# EAGLE schematic max_3949_breakout (EAGLE 9.2.2)
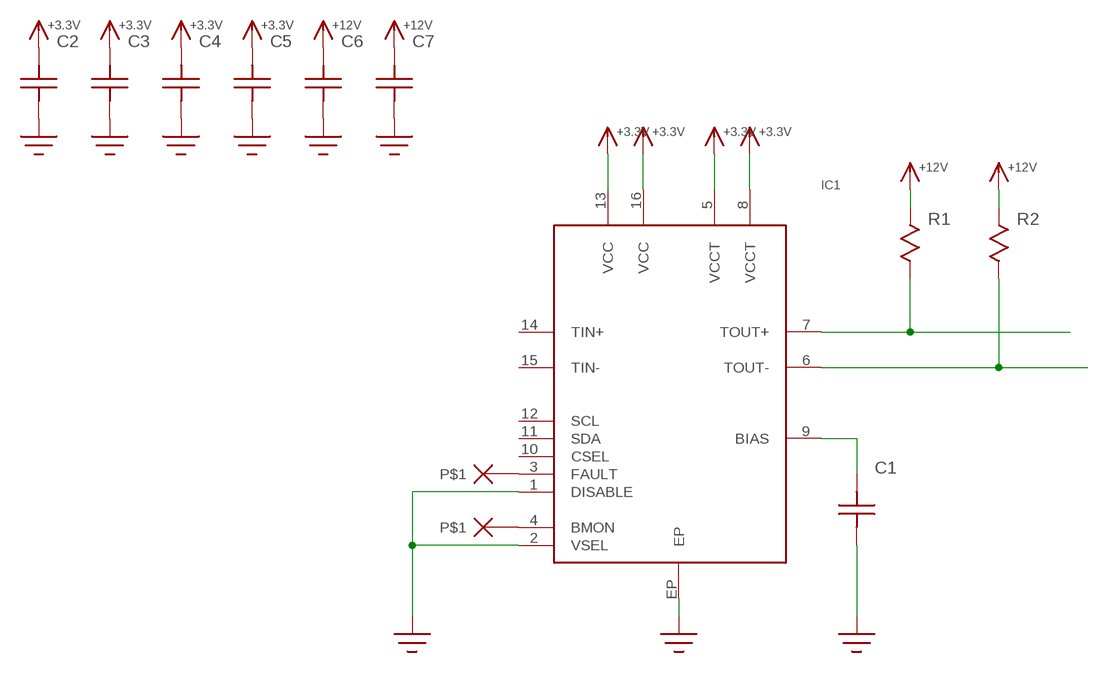
[diagram p0: schematic, sheet 1]

## Parts
C1  C0603  [C0603]
C2  C0603  [C0603]
C3  C0603  [C0603]
C4  C0603  [C0603]
C5  C0603  [C0603]
C6  C0603  [C0603]
C7  C0603  [C0603]
IC1  MAX3949  [TQFN16]
R1  R1206  [R1206]
R2  R1206  [R1206]
U$22  NO_CONNECT  (no package)
U$23  NO_CONNECT  (no package)

## Nets
+3.3V: C2.P$2 C3.P$2 C4.P$2 C5.P$2 IC1.5(VCCT) IC1.8(VCCT) IC1.13(VCC) IC1.16(VCC)
+12V: C6.P$2 C7.P$2 R1.P$1 R2.P$1
GND: C1.P$1 C2.P$1 C3.P$1 C4.P$1 C5.P$1 C6.P$1 C7.P$1 IC1.1(DISABLE) IC1.2(VSEL) IC1.EP
N$1: C1.P$2 IC1.9(BIAS)
N$2: IC1.7(TOUT+) R1.P$2
N$3: IC1.6(TOUT-) R2.P$2
N$5: IC1.3(FAULT) U$22.P$1
N$6: IC1.4(BMON) U$23.P$1
Unconnected: IC1.10(CSEL) IC1.11(SDA) IC1.12(SCL) IC1.14(TIN+) IC1.15(TIN-)

## Library data of the parts
C1-C7 = yapo:C
IC1 = yapo:MAX3949
R1 R2 = yapo:R
U$22 U$23 = yapo:NO_CONNECT